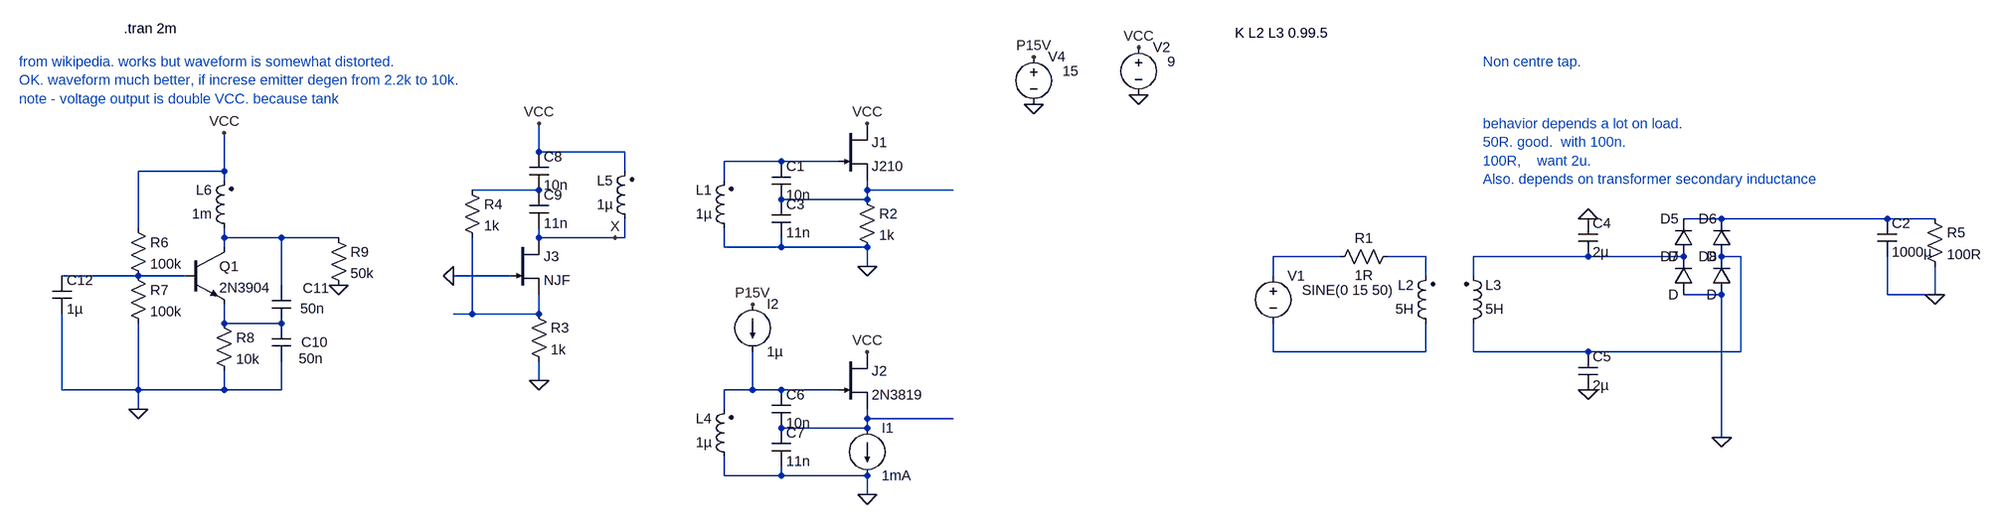
[diagram p0: schematic Draft100.asc]
Draft100.asc, the LTspice schematic file:
Version 4
SHEET 1 5720 1740
WIRE -480 -256 -480 -304
WIRE -336 -256 -480 -256
WIRE 48 -240 -48 -240
WIRE 144 -240 48 -240
WIRE -1008 -224 -1008 -288
WIRE -1008 -224 -1152 -224
WIRE -336 -224 -336 -256
WIRE -1008 -208 -1008 -224
WIRE -48 -208 -48 -240
WIRE -480 -192 -592 -192
WIRE 192 -192 192 -208
WIRE 336 -192 192 -192
WIRE 192 -176 192 -192
WIRE 192 -176 48 -176
WIRE 1840 -144 1776 -144
WIRE 2176 -144 1840 -144
WIRE 2256 -144 2176 -144
WIRE -1152 -128 -1152 -224
WIRE -1008 -112 -1008 -128
WIRE -912 -112 -1008 -112
WIRE -816 -112 -912 -112
WIRE -480 -112 -480 -128
WIRE -352 -112 -480 -112
WIRE -336 -112 -336 -144
WIRE -336 -112 -352 -112
WIRE -1008 -96 -1008 -112
WIRE -48 -96 -48 -128
WIRE 48 -96 48 -112
WIRE 48 -96 -48 -96
WIRE 192 -96 48 -96
WIRE 1200 -80 1088 -80
WIRE 1344 -80 1280 -80
WIRE 1616 -80 1424 -80
WIRE 1776 -80 1616 -80
WIRE 1872 -80 1840 -80
WIRE 192 -64 192 -96
WIRE -1152 -48 -1280 -48
WIRE -1072 -48 -1152 -48
WIRE -528 -48 -624 -48
WIRE 1088 -48 1088 -80
WIRE 1344 -48 1344 -80
WIRE 1424 -48 1424 -80
WIRE -912 -32 -912 -112
WIRE 1840 -16 1776 -16
WIRE 2176 -16 2176 -80
WIRE 2256 -16 2256 -64
WIRE 2256 -16 2176 -16
WIRE -592 16 -592 -112
WIRE -592 16 -624 16
WIRE -480 16 -480 -16
WIRE -480 16 -592 16
WIRE -1008 32 -1008 0
WIRE -912 32 -1008 32
WIRE 1088 80 1088 32
WIRE 1344 80 1344 32
WIRE 1344 80 1088 80
WIRE 1424 80 1424 32
WIRE 1616 80 1424 80
WIRE 1872 80 1872 -80
WIRE 1872 80 1616 80
WIRE -480 128 -480 96
WIRE -1280 144 -1280 16
WIRE -1152 144 -1152 32
WIRE -1152 144 -1280 144
WIRE -1008 144 -1008 112
WIRE -1008 144 -1152 144
WIRE -912 144 -912 96
WIRE -912 144 -1008 144
WIRE 0 144 0 80
WIRE 0 144 -48 144
WIRE 48 144 0 144
WIRE 144 144 48 144
WIRE -1152 176 -1152 144
WIRE -48 176 -48 144
WIRE 192 192 192 176
WIRE 336 192 192 192
WIRE 192 208 192 192
WIRE 192 208 48 208
WIRE 1840 224 1840 -16
WIRE -48 288 -48 256
WIRE 48 288 48 272
WIRE 48 288 -48 288
WIRE 192 288 48 288
WIRE 192 320 192 288
FLAG 784 -352 0
FLAG 784 -432 VCC
FLAG 608 -336 0
FLAG 608 -416 P15V
FLAG 2256 -16 0
FLAG 1616 -144 0
FLAG 1616 144 0
FLAG 1840 224 0
FLAG 192 -64 0
FLAG 192 320 0
FLAG 0 0 P15V
FLAG 192 -304 VCC
FLAG 192 80 VCC
FLAG -480 -304 VCC
FLAG -624 -48 0
FLAG -480 128 0
FLAG -352 -112 X
FLAG -1008 -288 VCC
FLAG -1152 176 0
FLAG -816 -32 0
SYMBOL voltage 784 -448 R0
WINDOW 123 0 0 Left 0
WINDOW 39 0 0 Left 0
WINDOW 3 48 40 Left 2
SYMATTR Value 9
SYMATTR InstName V2
SYMBOL ind2 1408 48 M180
WINDOW 0 36 80 Left 2
WINDOW 3 36 40 Left 2
SYMATTR InstName L3
SYMATTR Value 5H
SYMATTR Type ind
SYMBOL voltage 608 -432 R0
WINDOW 123 0 0 Left 0
WINDOW 39 0 0 Left 0
WINDOW 3 48 40 Left 2
SYMATTR Value 15
SYMATTR InstName V4
SYMBOL ind2 1360 48 R180
WINDOW 0 36 80 Left 2
WINDOW 3 36 40 Left 2
SYMATTR InstName L2
SYMATTR Value 5H
SYMATTR Type ind
SYMBOL diode 1792 -80 R180
WINDOW 0 24 64 Left 2
WINDOW 3 24 0 Left 2
SYMATTR InstName D5
SYMBOL diode 1856 -80 R180
WINDOW 0 24 64 Left 2
WINDOW 3 24 0 Left 2
SYMATTR InstName D6
SYMBOL diode 1792 -16 R180
WINDOW 0 24 64 Left 2
WINDOW 3 24 0 Left 2
SYMATTR InstName D7
SYMBOL diode 1856 -16 R180
WINDOW 0 24 64 Left 2
WINDOW 3 24 0 Left 2
SYMATTR InstName D8
SYMBOL cap 2160 -144 R0
SYMATTR InstName C2
SYMATTR Value 1000µ
SYMBOL res 2240 -160 R0
SYMATTR InstName R5
SYMATTR Value 100R
SYMBOL voltage 1088 -64 R0
WINDOW 123 0 0 Left 0
WINDOW 39 0 0 Left 0
WINDOW 3 48 40 Left 2
SYMATTR Value SINE(0 15 50)
SYMATTR InstName V1
SYMBOL res 1296 -96 R90
WINDOW 0 0 56 VBottom 2
WINDOW 3 32 56 VTop 2
SYMATTR InstName R1
SYMATTR Value 1R
SYMBOL cap 1600 -144 R0
SYMATTR InstName C4
SYMATTR Value 2µ
SYMBOL cap 1600 80 R0
SYMATTR InstName C5
SYMATTR Value 2µ
SYMBOL ind2 -32 -112 R180
WINDOW 0 36 80 Left 2
WINDOW 3 36 40 Left 2
SYMATTR InstName L1
SYMATTR Value 1µ
SYMATTR Type ind
SYMBOL cap 32 -240 R0
SYMATTR InstName C1
SYMATTR Value 10n
SYMBOL cap 32 -176 R0
SYMATTR InstName C3
SYMATTR Value 11n
SYMBOL njf 144 -304 R0
SYMATTR InstName J1
SYMATTR Value J210
SYMBOL res 176 -192 R0
SYMATTR InstName R2
SYMATTR Value 1k
SYMBOL ind2 -32 272 R180
WINDOW 0 36 80 Left 2
WINDOW 3 36 40 Left 2
SYMATTR InstName L4
SYMATTR Value 1µ
SYMATTR Type ind
SYMBOL cap 32 144 R0
SYMATTR InstName C6
SYMATTR Value 10n
SYMBOL cap 32 208 R0
SYMATTR InstName C7
SYMATTR Value 11n
SYMBOL njf 144 80 R0
SYMATTR InstName J2
SYMATTR Value 2N3819
SYMBOL current 192 208 R0
WINDOW 123 0 0 Left 0
WINDOW 39 0 0 Left 0
SYMATTR InstName I1
SYMATTR Value 1mA
SYMBOL current 0 0 R0
WINDOW 123 0 0 Left 0
WINDOW 39 0 0 Left 0
SYMATTR InstName I2
SYMATTR Value 1µ
SYMBOL ind2 -320 -128 R180
WINDOW 0 36 80 Left 2
WINDOW 3 36 40 Left 2
SYMATTR InstName L5
SYMATTR Value 1µ
SYMATTR Type ind
SYMBOL cap -496 -256 R0
SYMATTR InstName C8
SYMATTR Value 10n
SYMBOL cap -496 -192 R0
SYMATTR InstName C9
SYMATTR Value 11n
SYMBOL res -496 0 R0
SYMATTR InstName R3
SYMATTR Value 1k
SYMBOL res -608 -208 R0
SYMATTR InstName R4
SYMATTR Value 1k
SYMBOL njf -528 -112 R0
SYMATTR InstName J3
SYMBOL ind2 -992 -112 R180
WINDOW 0 36 80 Left 2
WINDOW 3 36 40 Left 2
SYMATTR InstName L6
SYMATTR Value 1m
SYMATTR Type ind
SYMBOL res -1168 -144 R0
SYMATTR InstName R6
SYMATTR Value 100k
SYMBOL res -1168 -64 R0
SYMATTR InstName R7
SYMATTR Value 100k
SYMBOL npn -1072 -96 R0
SYMATTR InstName Q1
SYMATTR Value 2N3904
SYMBOL cap -928 32 R0
WINDOW 0 49 32 Left 2
WINDOW 3 45 59 Left 2
SYMATTR InstName C10
SYMATTR Value 50n
SYMBOL cap -928 -32 R0
WINDOW 0 52 5 Left 2
WINDOW 3 48 39 Left 2
SYMATTR InstName C11
SYMATTR Value 50n
SYMBOL res -1024 16 R0
SYMATTR InstName R8
SYMATTR Value 10k
SYMBOL cap -1296 -48 R0
SYMATTR InstName C12
SYMATTR Value 1µ
SYMBOL res -832 -128 R0
SYMATTR InstName R9
SYMATTR Value 50k
TEXT 1024 -456 Left 2 !K L2 L3 0.99.5
TEXT -1176 -464 Left 2 !.tran 2m
TEXT 1440 -304 Left 2 ;behavior depends a lot on load. \n50R. good.  with 100n. \n100R,    want 2u.\nAlso. depends on transformer secondary inductance
TEXT 1440 -408 Left 2 ;Non centre tap.
TEXT -1352 -408 Left 2 ;from wikipedia. works but waveform is somewhat distorted.\nOK. waveform much better, if increse emitter degen from 2.2k to 10k.\nnote - voltage output is double VCC. because tank

The netlist it stands for:
* Draft100.asc
V2 VCC 0 9
L3 N009 N008 5H
V4 P15V 0 15
L2 N013 N007 5H
D5 N008 N004 D
D6 N009 N004 D
D7 0 N008 D
D8 0 N009 D
C2 N004 0 1000µ
R5 N004 0 100R
V1 N006 N013 SINE(0 15 50)
R1 N007 N006 1R
C4 0 N008 2µ
C5 N009 0 2µ
L1 0 N001 1µ
C1 N001 N003 10n
C3 N003 0 11n
J1 VCC N001 N003 J210
R2 N003 0 1k
L4 0 N014 1µ
C6 N014 N015 10n
C7 N015 0 11n
J2 VCC N014 N015 2N3819
I1 N015 0 1mA
I2 P15V N014 1µ
L5 X VCC 1µ
C8 VCC N002 10n
C9 N002 X 11n
R3 N011 0 1k
R4 N002 N011 1k
J3 X 0 N011 NJF
L6 N005 VCC 1m
R6 VCC N010 100k
R7 N010 0 100k
Q1 N005 N010 N012 0 2N3904
C10 N012 0 50n
C11 N005 N012 50n
R8 N012 0 10k
C12 N010 0 1µ
R9 N005 0 50k
.model D D
.lib standard.dio
.model NPN NPN
.model PNP PNP
.lib standard.bjt
.model NJF NJF
.model PJF PJF
.lib standard.jft
K L2 L3 0.99.5
.tran 2m
* behavior depends a lot on load.
* 50R. good.  with 100n.
* 100R,    want 2u.
* Also. depends on transformer secondary inductance
* Non centre tap.
* from wikipedia. works but waveform is somewhat distorted.
* OK. waveform much better, if increse emitter degen from 2.2k to 10k.
* note - voltage output is double VCC. because tank
.backanno
.end